# Altium schematic sheet Kivipallur_joonis1.SchDoc
size A4; SheetNumber: 2; SheetTotal: 4
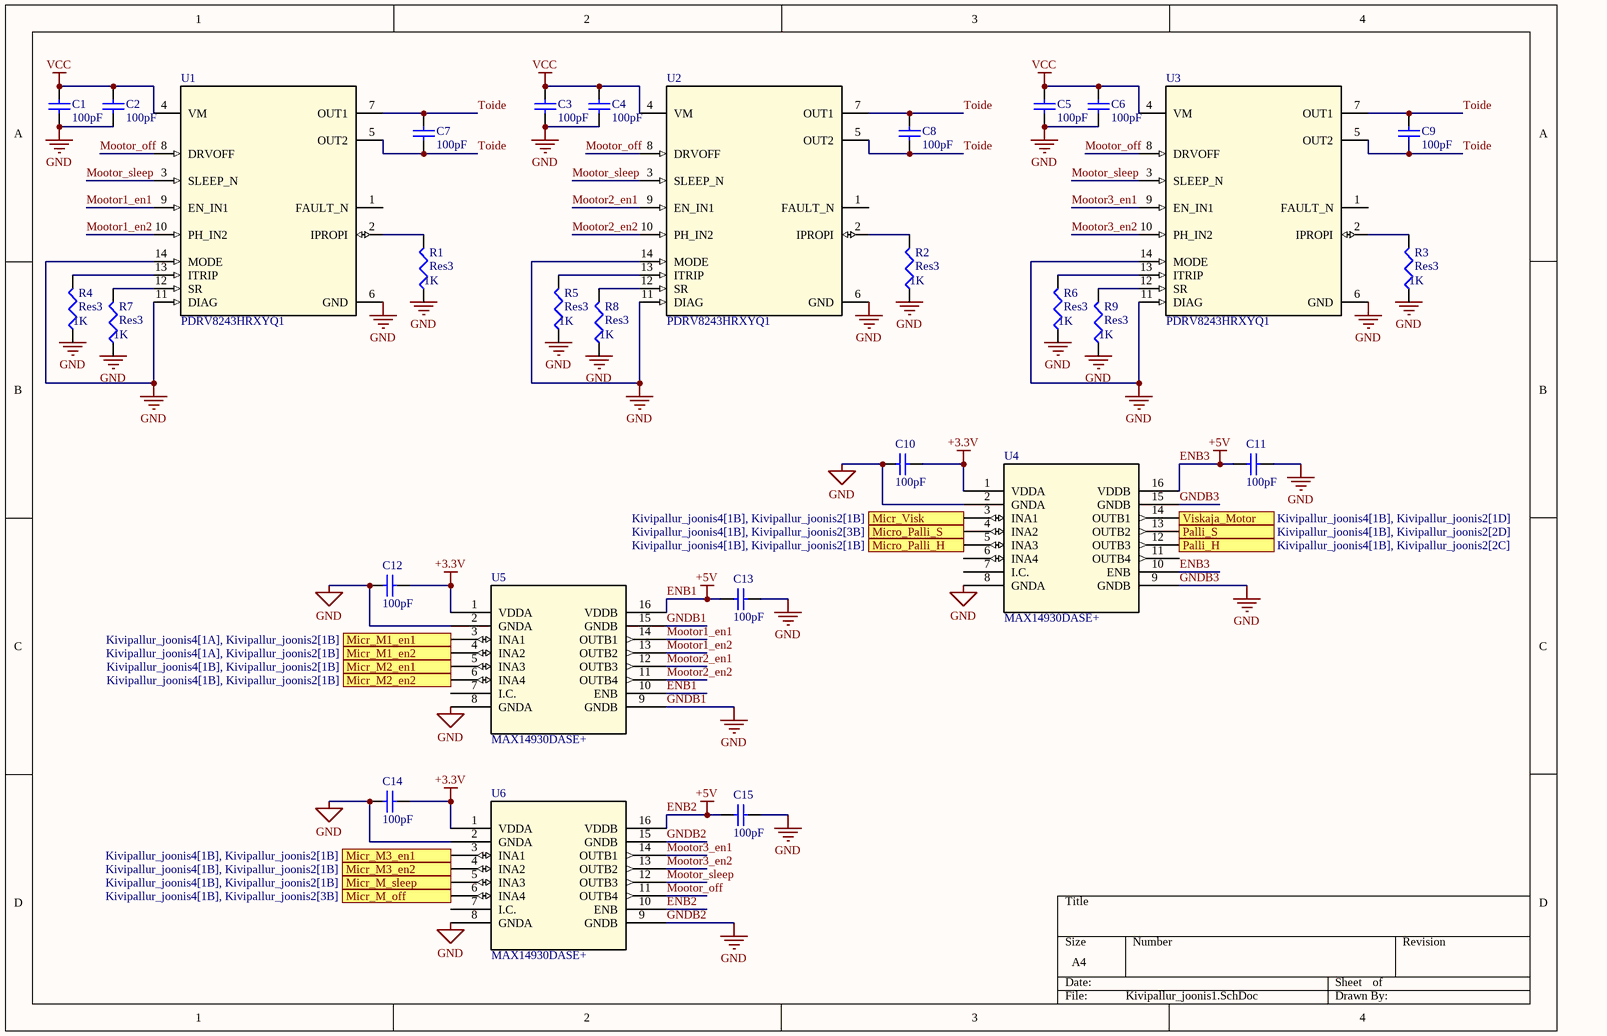
[diagram p0: Kivipallur_joonis1.SchDoc]

## Parts
C1  value 100pF  [C1206]  (hidden comment: Cap Semi)
C2  value 100pF  [C1206]  (hidden comment: Cap Semi)
C3  value 100pF  [C1206]  (hidden comment: Cap Semi)
C4  value 100pF  [C1206]  (hidden comment: Cap Semi)
C5  value 100pF  [C1206]  (hidden comment: Cap Semi)
C6  value 100pF  [C1206]  (hidden comment: Cap Semi)
C7  value 100pF  [C1206]  (hidden comment: Cap Semi)
C8  value 100pF  [C1206]  (hidden comment: Cap Semi)
C9  value 100pF  [C1206]  (hidden comment: Cap Semi)
C10  value 100pF  [C1206]  (hidden comment: Cap Semi)
C11  value 100pF  [C1206]  (hidden comment: Cap Semi)
C12  value 100pF  [C1206]  (hidden comment: Cap Semi)
C13  value 100pF  [C1206]  (hidden comment: Cap Semi)
C14  value 100pF  [C1206]  (hidden comment: Cap Semi)
C15  value 100pF  [C1206]  (hidden comment: Cap Semi)
R1  Res3  value 1K  [J1-0603]
R2  Res3  value 1K  [J1-0603]
R3  Res3  value 1K  [J1-0603]
R4  Res3  value 1K  [J1-0603]
R5  Res3  value 1K  [J1-0603]
R6  Res3  value 1K  [J1-0603]
R7  Res3  value 1K  [J1-0603]
R8  Res3  value 1K  [J1-0603]
R9  Res3  value 1K  [J1-0603]
U1  PDRV8243HRXYQ1  [RXY0014A-MFG]
U2  PDRV8243HRXYQ1  [RXY0014A-MFG]
U3  PDRV8243HRXYQ1  [RXY0014A-MFG]
U4  MAX14930DASE+  [21-0041_S16+1_MXM]
U5  MAX14930DASE+  [21-0041_S16+1_MXM]
U6  MAX14930DASE+  [21-0041_S16+1_MXM]

## Ports
Micr_M1_en1 (see Kivipallur_joonis4[1A], Kivipallur_joonis2[1B]), Micr_M1_en2 (see Kivipallur_joonis4[1A], Kivipallur_joonis2[1B]), Micr_M2_en1 (see Kivipallur_joonis4[1B], Kivipallur_joonis2[1B]), Micr_M2_en2 (see Kivipallur_joonis4[1B], Kivipallur_joonis2[1B]), Micr_M3_en1 (see Kivipallur_joonis4[1B], Kivipallur_joonis2[1B]), Micr_M3_en2 (see Kivipallur_joonis4[1B], Kivipallur_joonis2[1B]), Micr_M_off (see Kivipallur_joonis4[1B], Kivipallur_joonis2[3B]), Micr_M_sleep (see Kivipallur_joonis4[1B], Kivipallur_joonis2[1B]), Micr_Visk (see Kivipallur_joonis4[1B], Kivipallur_joonis2[1B]), Micro_Palli_H (see Kivipallur_joonis4[1B], Kivipallur_joonis2[1B]), Micro_Palli_S (see Kivipallur_joonis4[1B], Kivipallur_joonis2[3B]), Palli_H (see Kivipallur_joonis4[1B], Kivipallur_joonis2[2C]), Palli_S (see Kivipallur_joonis4[1B], Kivipallur_joonis2[2D]), Viskaja_Motor (see Kivipallur_joonis4[1B], Kivipallur_joonis2[1D])

## Nets
+3.3V: C10.2 C12.2 C14.2 U4.1(VDDA) U5.1(VDDA) U6.1(VDDA)
ENB1: C11.1 C13.1 C15.1 U4.10(ENB) U4.16(VDDB) U5.10(ENB) U5.16(VDDB) U6.10(ENB) U6.16(VDDB)  [also labelled +5V, ENB2, ENB3]
GNDB1: C1.1 C2.1 C3.1 C4.1 C5.1 C6.1 C10.1 C11.2 C12.1 C13.2 C14.1 C15.2 U1.6(GND) U1.11(DIAG) U1.14(MODE) U2.6(GND) U2.11(DIAG) U2.14(MODE) U3.6(GND) U3.11(DIAG) U3.14(MODE) U4.2(GNDA) U4.8(GNDA) U4.9(GNDB) U4.15(GNDB) U5.2(GNDA) U5.8(GNDA) U5.9(GNDB) U5.15(GNDB) U6.2(GNDA) U6.8(GNDA) U6.9(GNDB) U6.15(GNDB)  [also labelled GND, GNDB2, GNDB3]
VCC: C1.2 C2.2 C3.2 C4.2 C5.2 C6.2 U1.4(VM) U2.4(VM) U3.4(VM)
Micr_M1_en1: U5.3(INA1) ; port Micr_M1_en1
Micr_M1_en2: U5.4(INA2) ; port Micr_M1_en2
Micr_M2_en1: U5.5(INA3) ; port Micr_M2_en1
Micr_M2_en2: U5.6(INA4) ; port Micr_M2_en2
Micr_M3_en1: U6.3(INA1) ; port Micr_M3_en1
Micr_M3_en2: U6.4(INA2) ; port Micr_M3_en2
Micr_M_off: U6.6(INA4) ; port Micr_M_off
Micr_M_sleep: U6.5(INA3) ; port Micr_M_sleep
Micr_Visk: U4.3(INA1) ; port Micr_Visk
Micro_Palli_H: U4.5(INA3) ; port Micro_Palli_H
Micro_Palli_S: U4.4(INA2) ; port Micro_Palli_S
Mootor1_en1: U1.9(EN_IN1) U5.14(OUTB1)
Mootor1_en2: U1.10(PH_IN2) U5.13(OUTB2)
Mootor2_en1: U2.9(EN_IN1) U5.12(OUTB3)
Mootor2_en2: U2.10(PH_IN2) U5.11(OUTB4)
Mootor3_en1: U3.9(EN_IN1) U6.14(OUTB1)
Mootor3_en2: U3.10(PH_IN2) U6.13(OUTB2)
Mootor_off: U1.8(DRVOFF) U2.8(DRVOFF) U3.8(DRVOFF) U6.11(OUTB4)
Mootor_sleep: U1.3(SLEEP_N) U2.3(SLEEP_N) U3.3(SLEEP_N) U6.12(OUTB3)
Palli_H: U4.12(OUTB3) ; port Palli_H
Palli_S: U4.13(OUTB2) ; port Palli_S
Toide: C7.1 C7.2 C8.1 C8.2 C9.1 C9.2 U1.5(OUT2) U1.7(OUT1) U2.5(OUT2) U2.7(OUT1) U3.5(OUT2) U3.7(OUT1)
Viskaja_Motor: U4.14(OUTB1) ; port Viskaja_Motor
NetR1_2: R1.2 U1.2(IPROPI)
NetR2_2: R2.2 U2.2(IPROPI)
NetR3_2: R3.2 U3.2(IPROPI)
NetR4_2: R4.2 U1.13(ITRIP)
NetR5_2: R5.2 U2.13(ITRIP)
NetR6_2: R6.2 U3.13(ITRIP)
NetR7_2: R7.2 U1.12(SR)
NetR8_2: R8.2 U2.12(SR)
NetR9_2: R9.2 U3.12(SR)

Not connected (* = marked no-connect by the designer): R1 1; R2 1; R3 1; R4 1; R5 1; R6 1; R7 1; R8 1; R9 1; U1 1(FAULT_N); U2 1(FAULT_N); U3 1(FAULT_N); U4 6(INA4) 7(I.C.) 11(OUTB4); U5 7(I.C.); U6 7(I.C.)

## Notes on the sheet
- Labels drawn without touching a wire or pin: GND

## Library data of the parts
C1-C15 = Cap Semi: Capacitor (Semiconductor SIM Model); Published: 8-Jun-2000; PackageReference: C1206; Publisher: Altium Limited; PackageDescription: Chip Capacitor; LatestRevisionDate: 29-May-2009; LatestRevisionNote: IPC-7351 Footprint Added.
R1-R9 = Res3: Resistor; Published: 8-Jun-2000; LatestRevisionDate: 29-May-2009; LatestRevisionNote: IPC-7351 Footprint Added.; PackageReference: J1-0603; Publisher: Altium Limited; PackageDescription: Chip Resistor
U1-U3 = PDRV8243HRXYQ1: No Description Available; Mfr_Name: Texas Instruments; Type: DEV; RefDes: RefDes; Copyright: Copyright (C) 2022 Ultra Librarian. All rights reserved.; Manufacturer_Part_Number: PDRV8243HRXYQ1
U4-U6 = MAX14930DASE+: No Description Available; Mfr_Name: Maxim Integrated Products; Copyright: Copyright (C) 2022 Ultra Librarian. All rights reserved.; Manufacturer_Part_Number: MAX14930DASE+; RefDes: RefDes; Type: DEV